# EAGLE design Assignment-1 (EAGLE 9.6.2)
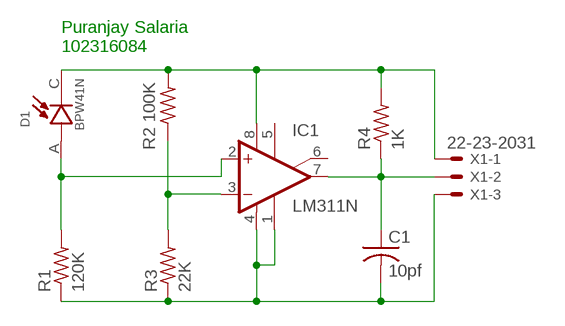
[diagram p0: schematic, sheet 1]

## Parts
C1  10pf  C-US025-050X050  [C025-050X050]
D1  BPW41N  [DIO_BPW41N]
IC1  LM311N  [DIL08]
R1  120K  R-US_0204/7  [0204/7]
R2  R2 100K  R-US_0204/7  [0204/7]
R3  22K  R-US_0204/7  [0204/7]
R4  1K  R-US_0204/7  [0204/7]
X1  22-23-2031  [22-23-2031]

## Nets
N$1: D1.A IC1.2(+IN) R1.2
N$2: D1.C IC1.8(V+) R2.2 R4.2 X1.1
N$3: IC1.3(-IN) R2.1 R3.2
N$4: C1.2 IC1.1(GND) IC1.4(V-) R1.1 R3.1 X1.3
N$5: C1.1 IC1.7(OUT) R4.1 X1.2
Unconnected: IC1.5(ON) IC1.6(ON/STR)

## Notes on the sheet
- Puranjay Salaria
  102316084

## Library data of the parts
C1 = rcl:C-US: CAPACITOR, American symbol; SPICEPREFIX: C
D1 = BPW41N:BPW41N: BPW41N Series 65° Side View 950 nm PIN Photodiode Check availability <https://pricing.snapeda.com/parts/BPW41N/Vishay%20Semiconductor%20Opto%20Division/view-part?ref=eda>; AVAILABILITY: In Stock; DESCRIPTION: Photodiode 940nm 130° Radial, Side View; MF: Vishay Semiconductor Opto Division; MP: BPW41N; PACKAGE: None; PRICE: None; PURCHASE-URL: https://pricing.snapeda.com/search/part/BPW41N/?ref=eda
IC1 = linear:LM311: COMPARATOR
R1-R4 = rcl:R-US_: RESISTOR, American symbol; SPICEPREFIX: R
X1 = con-molex:22-23-2031: .100" (2.54mm) Center Header - 3 Pin; MF: MOLEX; MPN: 22-23-2031; OC_FARNELL: 1462950; OC_NEWARK: 30C0862

## Board
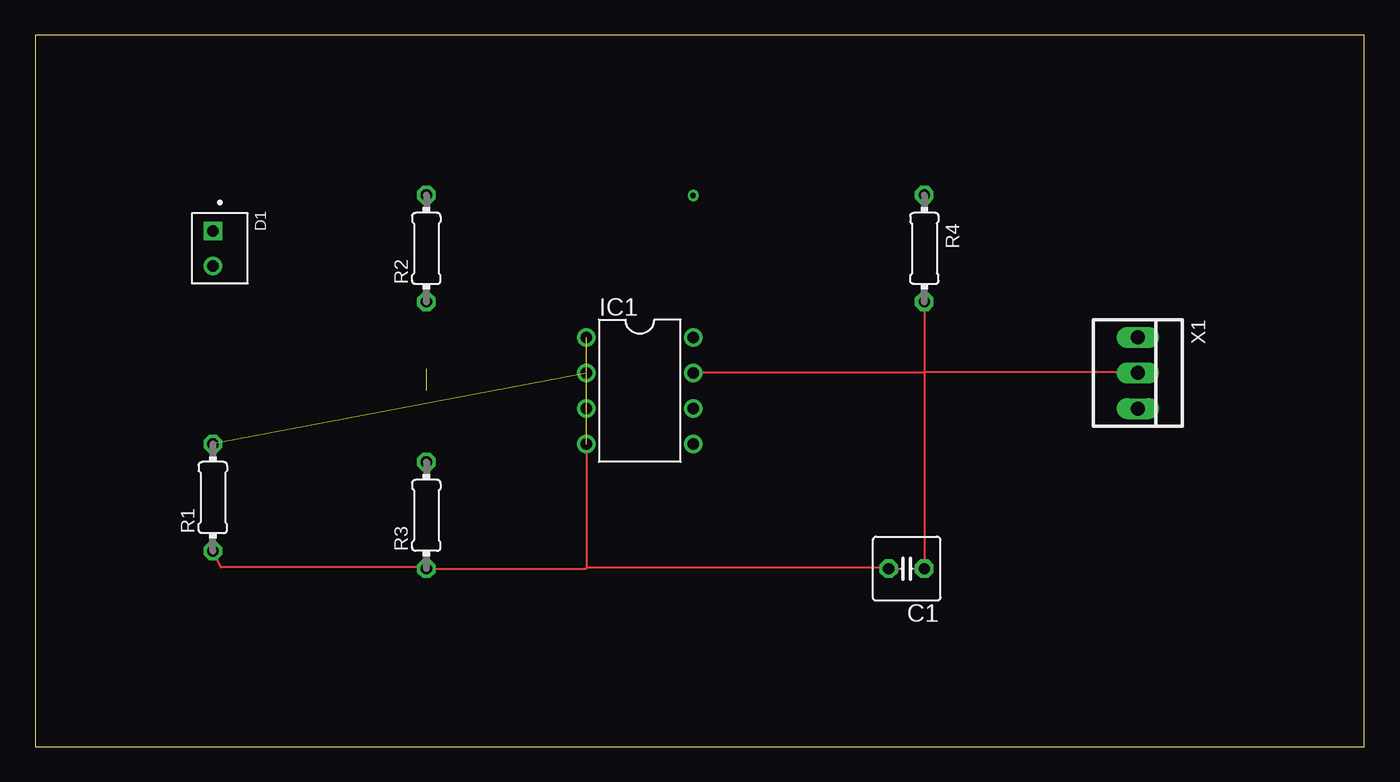
[diagram p1: board, top side]
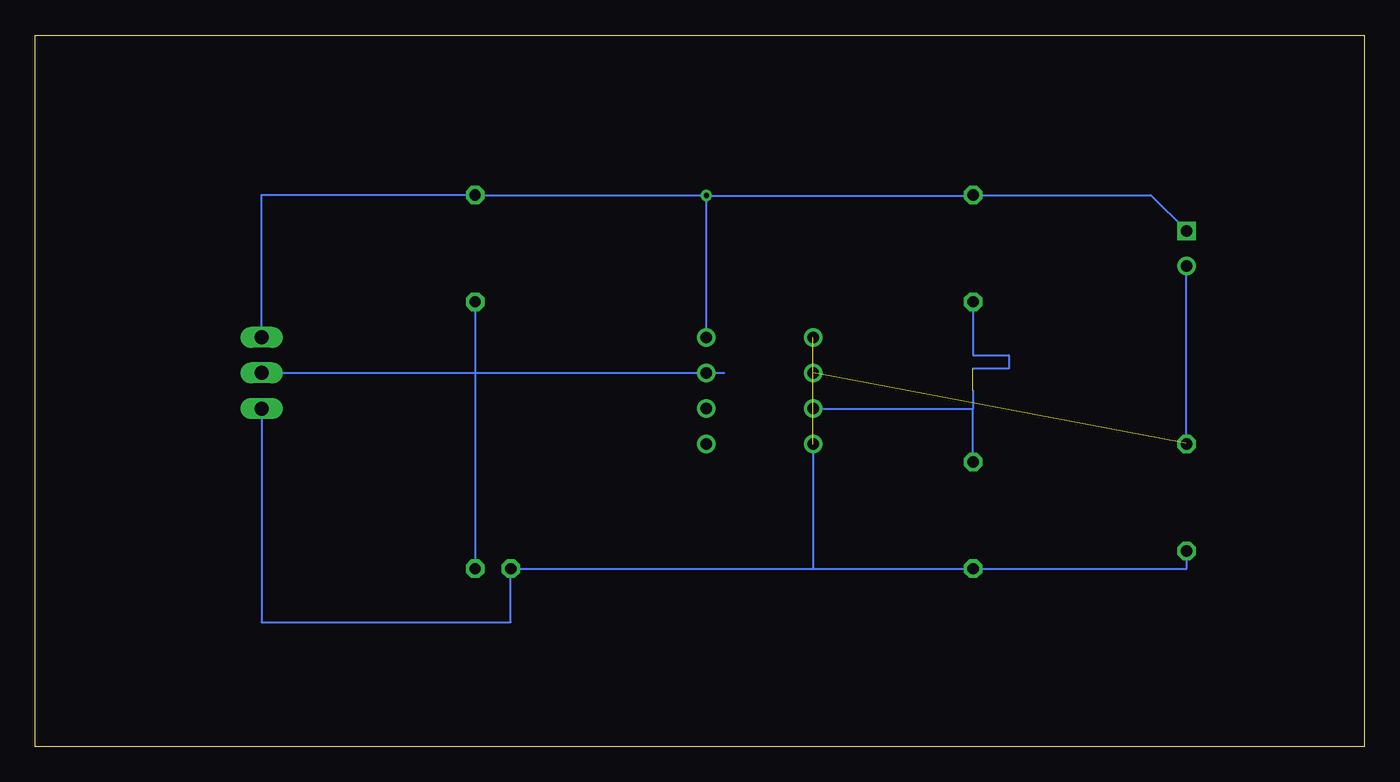
[diagram p2: board, bottom side, seen from below]

Size 94.92 x 50.79 mm. Coordinates in mm from the lower left corner, seen from the top.
Outline: 0,0 94.92,0 94.92,50.79 0,50.79 0,0
Copper layers (1*16): Top 0.035mm / dielectric 1.5mm / Bottom 0.035mm
Design rules "default": minimum track width 6mil, minimum drill 0.35mm, track to track 6mil, track to pad 6mil, pad to pad 6mil, via to via 6mil, smd to smd 6mil, copper to edge 40mil, drill to drill 6mil, minimum pad ring 10mil, minimum via ring 8mil, stop-mask expansion 4mil, vias tented up to drill 0mil, thermal gap 10mil

### Footprints (pad centres in the part's own frame; a part is rotated, then mirrored left to right if it is on the bottom)
C025-050X050 = drill 0.813 octagon: 1 -1.27,0; 2 1.27,0
DIO_BPW41N = drill 0.83 pad 1.25: A 1.25,0 | drill 0.83 pad 1.25 square: C -1.25,0
DIL08 = drill 0.813 pad 1.27: 1 -3.81,-3.81; 2 -1.27,-3.81; 3 1.27,-3.81; 4 3.81,-3.81; 5 3.81,3.81; 6 1.27,3.81; 7 -1.27,3.81; 8 -3.81,3.81
0204/7 = drill 0.813 octagon: 1 -3.81,0; 2 3.81,0
22-23-2031 = drill 1 long: 1 -2.54,0; 2 0,0; 3 2.54,0

### Placement (x,y rotation side)
C1  62.23,12.7 180 top
D1  12.7,35.56 270 top
IC1  43.18,25.4 270 top
R1  12.7,17.78 90 top
R2  27.94,35.56 90 top
R3  27.94,16.51 90 top
R4  63.5,35.56 90 top
X1  78.74,26.67 270 top

### Tracks (layer width: path | path; a pad name or v marks a point on that pad's centre or on a via)
N$1  (via drill 0.35)  (1 unrouted)
  Top 0.152: v12.75,21.64 R1.2 | v12.75,34.29 D1.A
  Bottom 0.152: v12.75,34.29 12.75,26.67 v12.75,21.64
N$2  (via drill 0.35)
  Top 0.152: v46.99,39.37 v46.99,39.32 | v27.99,39.32 R2.2
  Bottom 0.152: v46.99,39.37 R4.2 78.74,39.37 X1.1 | v27.99,39.32 v46.99,39.32 IC1.8 | R2.2 15.26,39.37 D1.C
N$3  (1 unrouted)
  Top 0.152: 27.99,20.42 R3.2 | 39.27,24.23 IC1.3
  Bottom 0.152: R3.2 27.94,24.13 | IC1.3 27.94,24.13 | 27.94,25.4 27.94,24.13 | R2.1 27.94,27.94 25.4,27.94 25.4,26.98 27.94,26.98
N$4  (1 unrouted)
  Top 0.152: R1.1 13.28,12.8 27.84,12.8 R3.1 39.32,12.7 39.42,12.8 60.91,12.8 C1.2 | 39.27,21.49 IC1.4 39.37,12.7
  Bottom 0.152: IC1.4 39.37,12.7 | 39.37,12.7 12.7,12.7 R1.1 | 39.37,12.7 C1.2 60.96,8.89 78.74,8.89 X1.3
N$5
  Top 0.152: R4.1 63.5,26.72 | 63.5,26.72 63.5,26.67 | 63.5,26.67 C1.1 | 63.5,26.67 IC1.7 | X1.2 78.69,26.72 63.5,26.72
  Bottom 0.152: R4.1 C1.1 | X1.2 45.72,26.67